# Altium schematic sheet 1uF 35V SCH.schdoc
size 124 x 101 mm
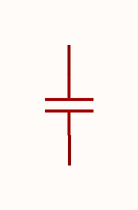
[diagram p0: 1uF 35V SCH.schdoc]

## Parts
C?  1uF,35V  [C0402]  (value not drawn)

## Nets

Not connected (* = marked no-connect by the designer): C? 1 2

## Library data of the parts
C? = CL05A105KL5NRNC: CAP CER 1UF 35V X5R 0402; Manufacturer: SAMSUNG(三星); Add into BOM: yes; Tolerance: ±10%; Symbol: CL05A105KL5NRNC; Device: CL05A105KL5NRNC; LCSC Part Name: 1uF ±10% 35V; Supplier Part: C307413; Manufacturer Part: CL05A105KL5NRNC; Supplier Footprint: 0402; JLCPCB Part Class: Extended Part; Datasheet: https://atta.szlcsc.com/upload/public/pdf/source/20160218/1457707763339.pdf; Supplier: LCSC; Convert to PCB: yes; Value: 1uF; LCSC Part Number: C307413